# EAGLE design scheme (EAGLE 6.5.0)
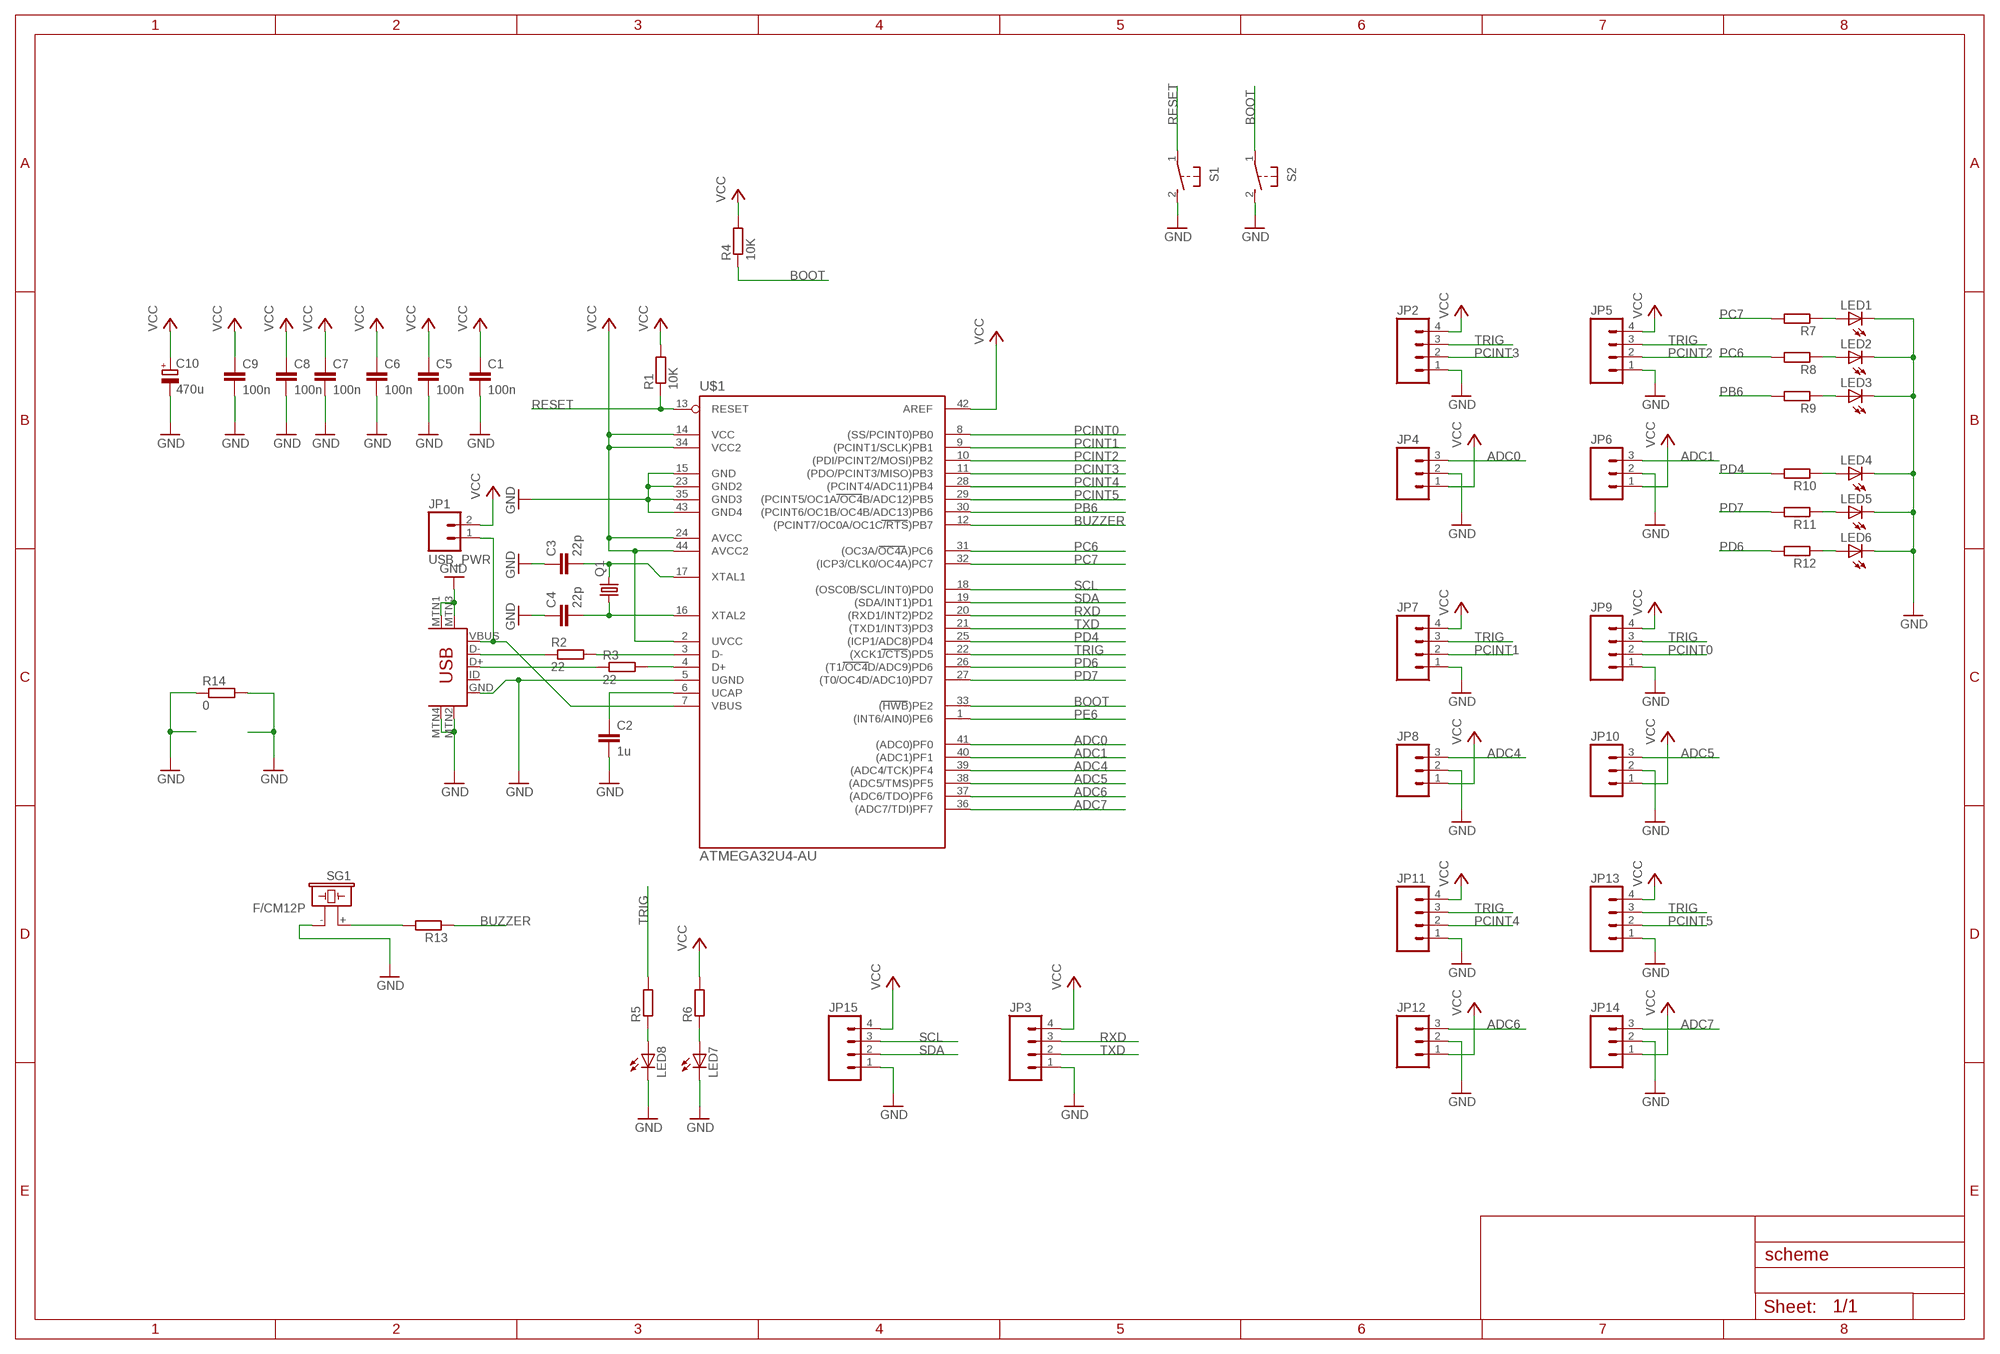
[diagram p0: schematic, sheet 1]

## Parts
C1  100n  C-EUC0805  [C0805]
C2  1u  C-EUC0805  [C0805]
C3  22p  C-EUC0805  [C0805]
C4  22p  C-EUC0805  [C0805]
C5  100n  C-EUC0805  [C0805]
C6  100n  C-EUC0805  [C0805]
C7  100n  C-EUC0805  [C0805]
C8  100n  C-EUC0805  [C0805]
C9  100n  C-EUC0805  [C0805]
C10  470u  CPOL-EUE3.5-8  [E3,5-8]
JP1  USB_PWR  M02PTH  [1X02]
JP2  M04PTH  [1X04]
JP3  M04PTH  [1X04]
JP4  M03PTH  [1X03]
JP5  M04PTH  [1X04]
JP6  M03PTH  [1X03]
JP7  M04PTH  [1X04]
JP8  M03PTH  [1X03]
JP9  M04PTH  [1X04]
JP10  M03PTH  [1X03]
JP11  M04PTH  [1X04]
JP12  M03PTH  [1X03]
JP13  M04PTH  [1X04]
JP14  M03PTH  [1X03]
JP15  M04PTH  [1X04]
LED1  LEDSMT1206  [1206]
LED2  LEDSMT1206  [1206]
LED3  LEDSMT1206  [1206]
LED4  LEDSMT1206  [1206]
LED5  LEDSMT1206  [1206]
LED6  LEDSMT1206  [1206]
LED7  LEDSMT1206  [1206]
LED8  LEDSMT1206  [1206]
Q1  CRYSTALHC49S  [HC49/S]
R1  10K  R-EU_R0805  [R0805]
R2  22  R-EU_R0805  [R0805]
R3  22  R-EU_R0805  [R0805]
R4  10K  R-EU_R0805  [R0805]
R5  R-EU_M0805  [M0805]
R6  R-EU_M0805  [M0805]
R7  R-EU_M0805  [M0805]
R8  R-EU_M0805  [M0805]
R9  R-EU_M0805  [M0805]
R10  R-EU_M0805  [M0805]
R11  R-EU_M0805  [M0805]
R12  R-EU_M0805  [M0805]
R13  R-EU_M0805  [M0805]
R14  0  R-EU_M1206  [M1206]
S1  31-XX  [B3F-31XX]
S2  31-XX  [B3F-31XX]
SG1  F/CM12P  [F/CM12P]
U$1  ATMEGA32U4-AU  [TQFP44]
U$2  USB-MINIB-5PIN  [USB-MINIB]

## Nets
ADC0: JP4.3 U$1.41((ADC0)PF0)
ADC1: JP6.3 U$1.40((ADC1)PF1)
ADC4: JP8.3 U$1.39((ADC4/TCK)PF4)
ADC5: JP10.3 U$1.38((ADC5/TMS)PF5)
ADC6: JP12.3 U$1.37((ADC6/TDO)PF6)
ADC7: JP14.3 U$1.36((ADC7/TDI)PF7)
BOOT: R4.1 S2.1(P) U$1.33((HWB)PE2)
BUZZER: R13.1 U$1.12((PCINT7/OC0A/OC1C/RTS)PB7)
GND: C1.2 C2.2 C3.1 C4.1 C5.2 C6.2 C7.2 C8.2 C9.2 C10.- JP2.1 JP3.1 JP4.2 JP5.1 JP6.2 JP7.1 JP8.2 JP9.1 JP10.2 JP11.1 JP12.2 JP13.1 JP14.2 JP15.1 LED1.C LED2.C LED3.C LED4.C LED5.C LED6.C LED7.C LED8.C R14.1 R14.2 S1.2(S) S2.2(S) SG1.- U$1.5(UGND) U$1.15(GND) U$1.23(GND2) U$1.35(GND3) U$1.43(GND4) U$2.GND U$2.MTN1(MTN2) U$2.MTN2(MTN3) U$2.MTN3(MTN1) U$2.MTN4
N$1: JP1.1 U$1.7(VBUS) U$2.VBUS
N$2: R2.1 U$2.D-
N$3: R2.2 U$1.3(D-)
N$4: R3.2 U$1.4(D+)
N$5: R3.1 U$2.D+
N$11: C2.1 U$1.6(UCAP)
N$12: C4.2 Q1.1 U$1.16(XTAL2)
N$13: C3.2 Q1.2 U$1.17(XTAL1)
N$14: LED1.A R7.1
N$15: LED2.A R8.1
N$16: LED3.A R9.1
N$17: LED4.A R10.1
N$18: LED5.A R11.1
N$19: LED6.A R12.1
N$20: R13.2 SG1.+
N$22: LED8.A R5.1
N$23: LED7.A R6.1
PB6: R9.2 U$1.30((PCINT6/OC1B/OC4B/ADC13)PB6)
PC6: R8.2 U$1.31((OC3A/OC4A)PC6)
PC7: R7.2 U$1.32((ICP3/CLK0/OC4A)PC7)
PCINT0: JP9.2 U$1.8((SS/PCINT0)PB0)
PCINT1: JP7.2 U$1.9((PCINT1/SCLK)PB1)
PCINT2: JP5.2 U$1.10((PDI/PCINT2/MOSI)PB2)
PCINT3: JP2.2 U$1.11((PDO/PCINT3/MISO)PB3)
PCINT4: JP11.2 U$1.28((PCINT4/ADC11)PB4)
PCINT5: JP13.2 U$1.29((PCINT5/OC1A/OC4B/ADC12)PB5)
PD4: R10.2 U$1.25((ICP1/ADC8)PD4)
PD6: R12.2 U$1.26((T1/OC4D/ADC9)PD6)
PD7: R11.2 U$1.27((T0/OC4D/ADC10)PD7)
PE6: U$1.1((INT6/AIN0)PE6)
RESET: R1.1 S1.1(P) U$1.13(RESET)
RXD: JP3.3 U$1.20((RXD1/INT2)PD2)
SCL: JP15.3 U$1.18((OSC0B/SCL/INT0)PD0)
SDA: JP15.2 U$1.19((SDA/INT1)PD1)
TRIG: JP2.3 JP5.3 JP7.3 JP9.3 JP11.3 JP13.3 R5.2 U$1.22((XCK1/CTS)PD5)
TXD: JP3.2 U$1.21((TXD1/INT3)PD3)
VCC: C1.1 C5.1 C6.1 C7.1 C8.1 C9.1 C10.+ JP1.2 JP2.4 JP3.4 JP4.1 JP5.4 JP6.1 JP7.4 JP8.1 JP9.4 JP10.1 JP11.4 JP12.1 JP13.4 JP14.1 JP15.4 R1.2 R4.2 R6.2 U$1.2(UVCC) U$1.14(VCC) U$1.24(AVCC) U$1.34(VCC2) U$1.42(AREF) U$1.44(AVCC2)
Unconnected: U$2.ID

## Library data of the parts
C1-C9 = rcl:C-EU: CAPACITOR, European symbol
C10 = rcl:CPOL-EU: POLARIZED CAPACITOR, European symbol
JP1 = SparkFun-Connectors:M02: Standard 2-pin 0.1" header. Use with - straight break away headers ( PRT-00116) - right angle break away headers (PRT-00553) - swiss pins (PRT-00743) - machine pins (PRT-00117) - female headers (PRT-00115) Molex polarized connector foot print use with: PRT-08233 with associated crimp pins and housings. 2.54_SCREWTERM for use with PRT-10571. 3.5mm Screw Terminal footprints for PRT-08084 5mm Screw Terminal footprints for use with PRT-08433
JP2 JP3 JP5 JP7 JP9 JP11 JP13 JP15 = SparkFun-Connectors:M04: Header 4 Standard 4-pin 0.1" header. Use with straight break away headers (SKU : PRT-00116), right angle break away headers (PRT-00553), swiss pins (PRT-00743), machine pins (PRT-00117), and female headers (PRT-00115). Molex polarized connector foot print use with SKU : PRT-08231 with associated crimp pins and housings. 1MM SMD Version SKU: PRT-10208
JP4 JP6 JP8 JP10 JP12 JP14 = SparkFun-Connectors:M03: Header 3 Standard 3-pin 0.1" header. Use with straight break away headers (SKU : PRT-00116), right angle break away headers (PRT-00553), swiss pins (PRT-00743), machine pins (PRT-00117), and female headers (PRT-00115). Molex polarized connector foot print use with SKU : PRT-08232 with associated crimp pins and housings.
LED1-LED8 = led:LED: LED OSRAM: - CHIPLED LG R971, LG N971, LY N971, LG Q971, LY Q971, LO R971, LY R971 LH N974, LH R974 LS Q976, LO Q976, LY Q976 LO Q996 - Hyper CHIPLED LW Q18S LB Q993, LB Q99A, LB R99A - SideLED LS A670, LO A670, LY A670, LG A670, LP A670 LB A673, LV A673, LT A673, LW A673 LH A674 LY A675 LS A676, LA A676, LO A676, LY A676, LW A676 LS A679, LY A679, LG A679 - Hyper Micro SIDELED® LS Y876, LA Y876, LO Y876, LY Y876 LT Y87S - SmartLED LW L88C, LW L88S LB L89C, LB L89S, LG L890 LS L89K, LO L89K, LY L89K LS L896, LA L896, LO L896, LY L896 - TOPLED LS T670, LO T670, LY T670, LG T670, LP T670 LSG T670, LSP T670, LSY T670, LOP T670, LYG T670 LG T671, LOG T671, LSG T671 LB T673, LV T673, LT T673, LW T673 LH T674 LS T676, LA T676, LO T676, LY T676, LB T676, LH T676, LSB T676, LW T676 LB T67C, LV T67C, LT T67C, LS T67K, LO T67K, LY T67K, LW E67C LS E67B, LA E67B, LO E67B, LY E67B, LB E67C, LV E67C, LT E67C LW T67C LS T679, LY T679, LG T679 LS T770, LO T770, LY T770, LG T770, LP T770 LB T773, LV T773, LT T773, LW T773 LH T774 LS E675, LA E675, LY E675, LS T675 LS T776, LA T776, LO T776, LY T776, LB T776 LHGB T686 LT T68C, LB T68C - Hyper Mini TOPLED® LB M676 - Mini TOPLED Santana® LG M470 LS M47K, LO M47K, LY M47K Source: http://www.osram.convergy.de LUXEON: - LUMILED® LXK2-PW12-R00, LXK2-PW12-S00, LXK2-PW14-U00, LXK2-PW14-V00 LXK2-PM12-R00, LXK2-PM12-S00, LXK2-PM14-U00 LXK2-PE12-Q00, LXK2-PE12-R00, LXK2-PE12-S00, LXK2-PE14-T00, LXK2-PE14-U00 LXK2-PB12-K00, LXK2-PB12-L00, LXK2-PB12-M00, LXK2-PB14-N00, LXK2-PB14-P00, LXK2-PB14-Q00 LXK2-PR12-L00, LXK2-PR12-M00, LXK2-PR14-Q00, LXK2-PR14-R00 LXK2-PD12-Q00, LXK2-PD12-R00, LXK2-PD12-S00 LXK2-PH12-R00, LXK2-PH12-S00 LXK2-PL12-P00, LXK2-PL12-Q00, LXK2-PL12-R00 Source: www.luxeon.com KINGBRIGHT: KA-3528ASYC Source: www.kingbright.com
Q1 = crystal:CRYSTAL: CRYSTAL; OC_FARNELL: 1667008; OC_NEWARK: unknown
R1-R14 = rcl:R-EU_: RESISTOR, European symbol
S1 S2 = switch-omron:31-XX: OMRON SWITCH; MPN: B3F-3100; OC_FARNELL: 959704; OC_NEWARK: 36M3582
SG1 = buzzer:F/CM12P: BUZZER Source: Buerklin; OC_FARNELL: unknown; OC_NEWARK: unknown
U$1 = mega32U4:ATMEGA32U4-AU
U$2 = SparkFun-Connectors:USB-MINIB: Mini-USB "B" connector with 5th pin broken out. Created new symbol breaking out 5th "ID" pin in mini/micro USB connector spec. See: http://en.wikipedia.org/wiki/Mini_usb#Cables. Uses same footprint as 4-pin symbol. Also added pins to connect to mounting / shield pads if required (probably not generally needed as signals aren't shielded once they leave the connector).

## Board
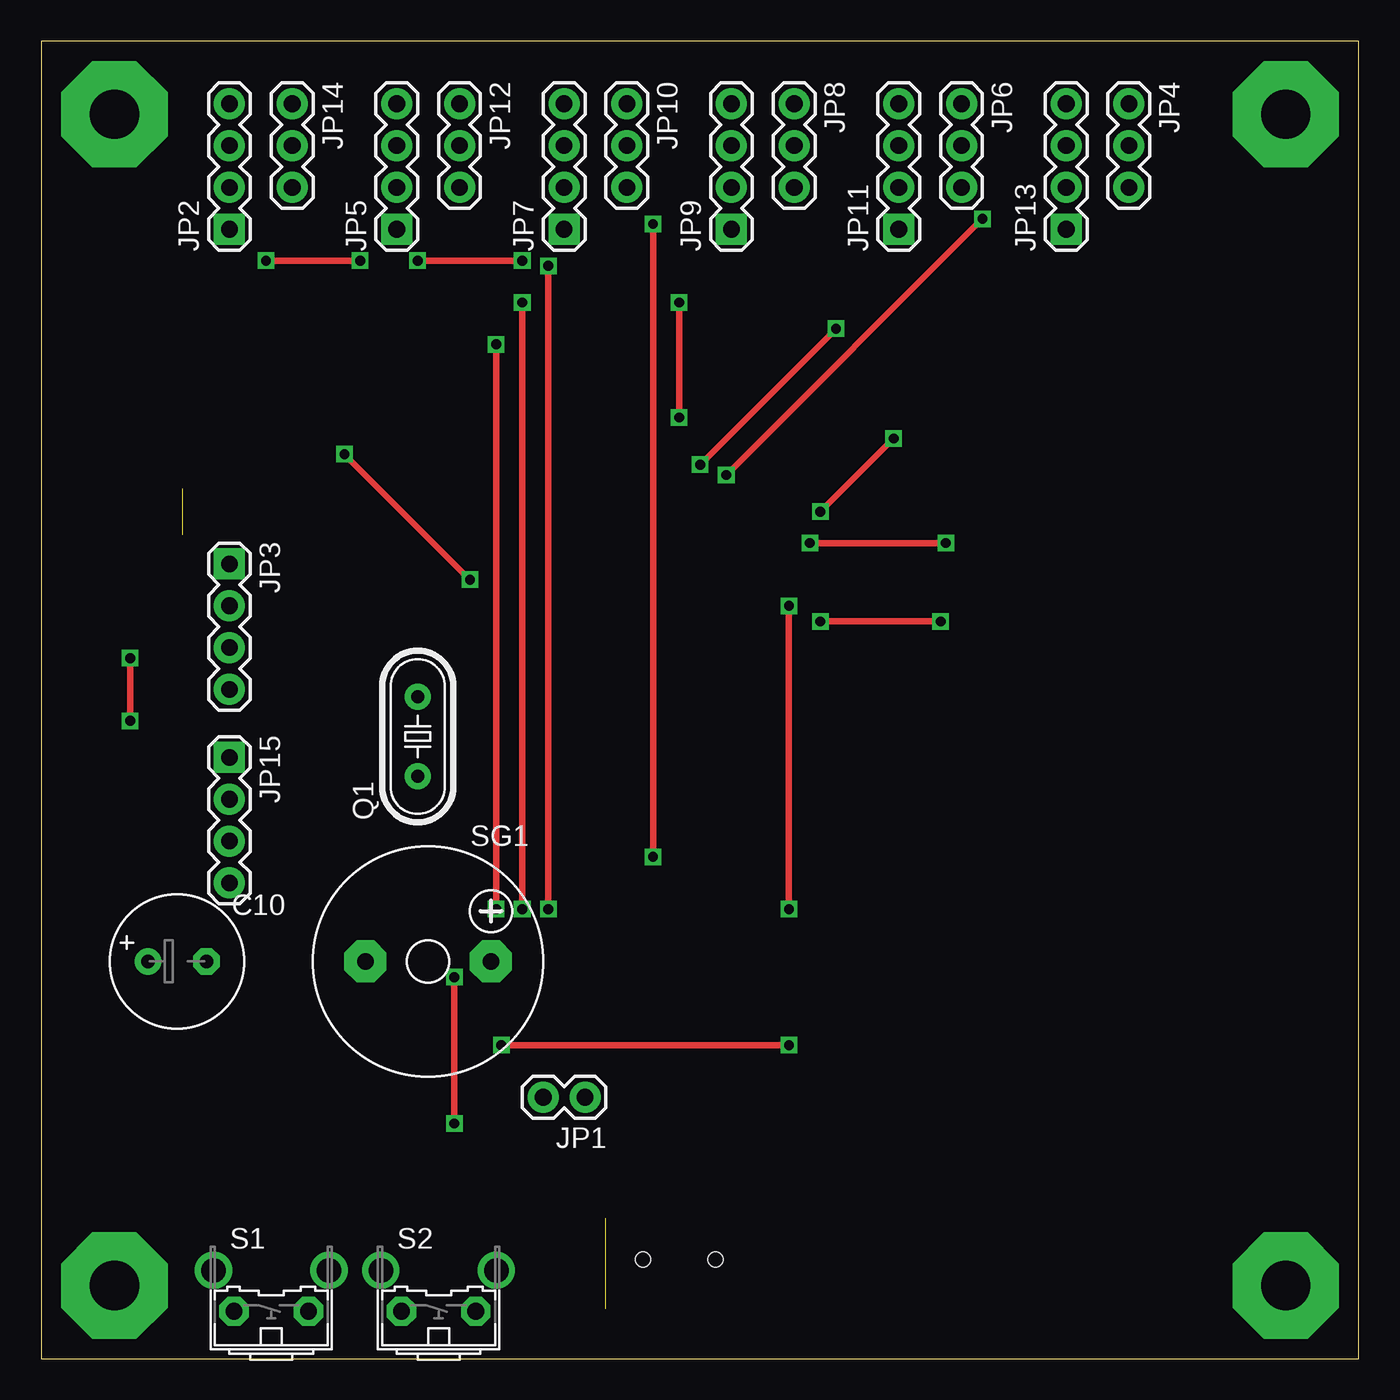
[diagram p1: board, top side]
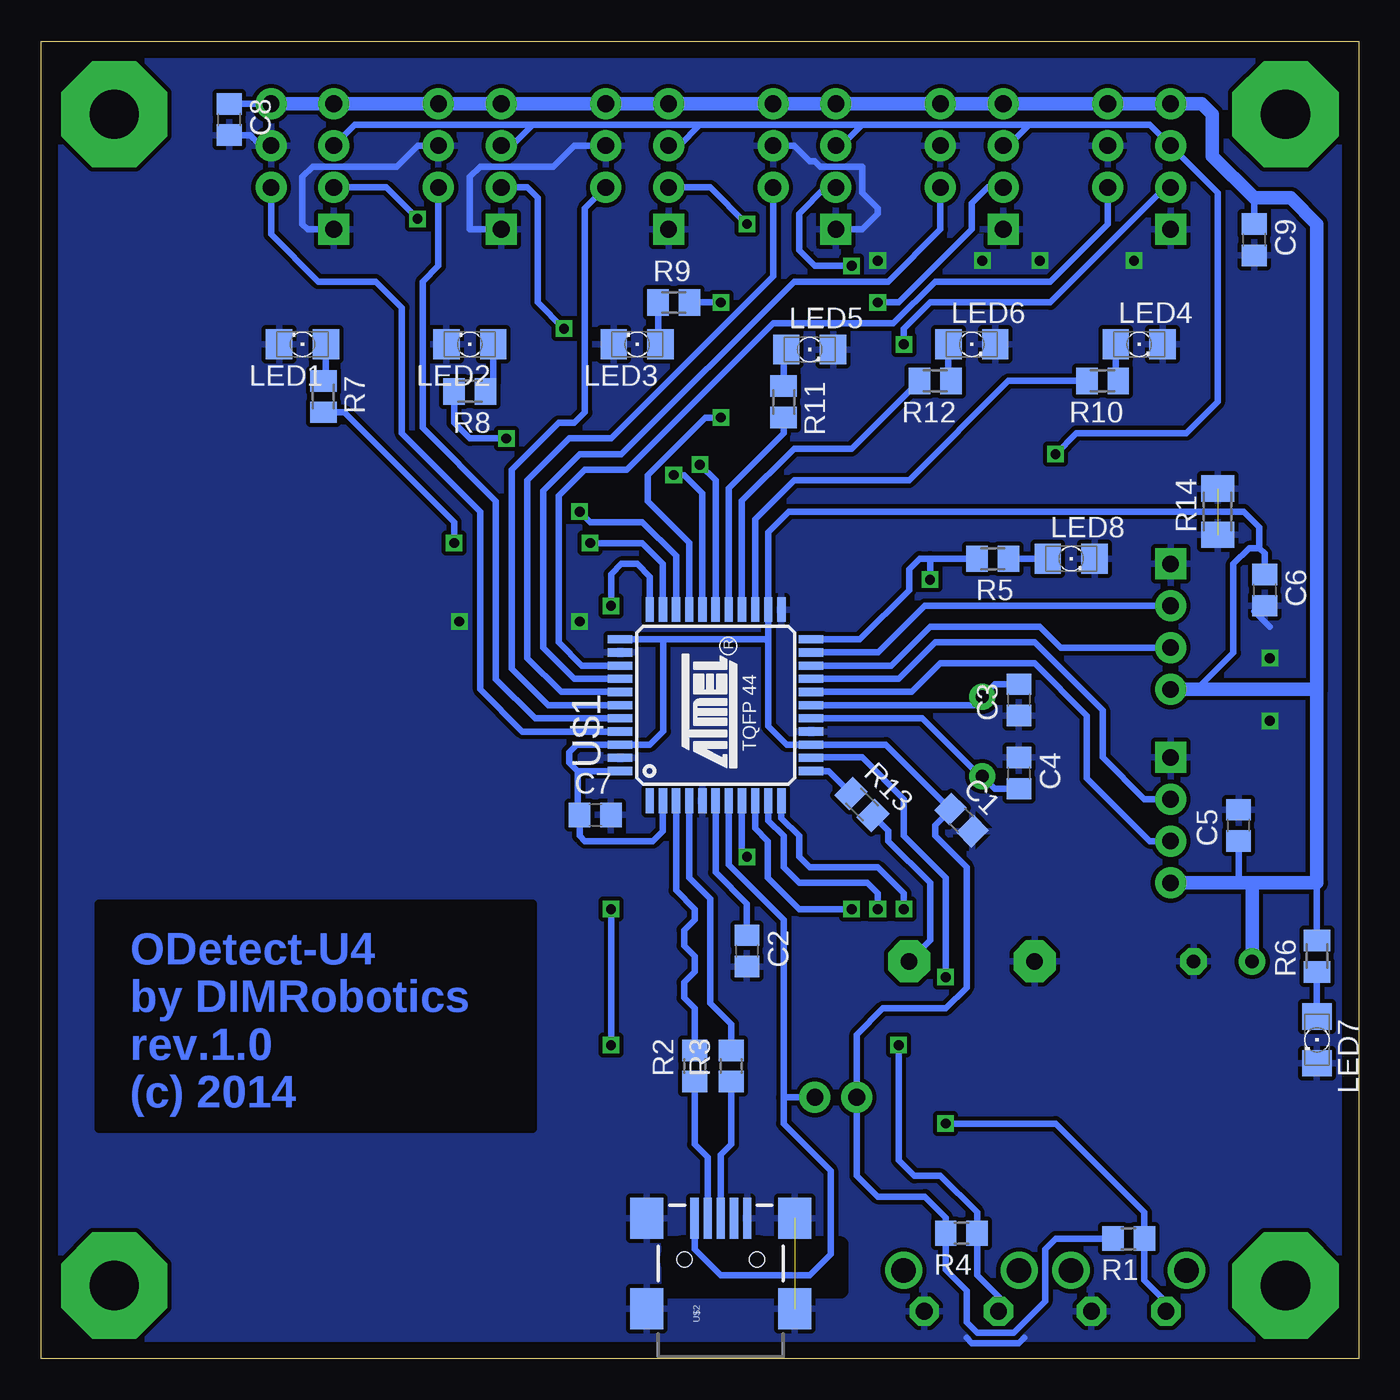
[diagram p2: board, bottom side, seen from below]

Size 80 x 80 mm. Coordinates in mm from the lower left corner, seen from the top.
Outline: 0,0 80,0 80,80 0,80 0,0
Copper layers (1*16): Top 0.035mm / dielectric 1.5mm / Bottom 0.035mm
Design rules "lut": minimum track width 10mil, minimum drill 24mil, track to track 8mil, track to pad 8mil, pad to pad 8mil, via to via 8mil, smd to smd 8mil, copper to edge 40mil, drill to drill 8mil, minimum pad ring 15mil, minimum via ring 8mil, stop-mask expansion 4mil, vias tented up to drill 0mil, thermal gap 10mil
bRestrict: 8 lines

### Footprints (pad centres in the part's own frame; a part is rotated, then mirrored left to right if it is on the bottom)
C0805 = smd 1.3 x 1.5: 1 -0.95,0; 2 0.95,0
E3,5-8 = drill 0.813 pad 1.6: + -1.778,0 | drill 0.813 pad 1.6 octagon: - 1.778,0
1X02 = drill 1.016 pad 1.88: 1 0,0; 2 2.54,0
1X04 = drill 1.016 pad 1.88 square: 1 0,0 | drill 1.016 pad 1.88: 2 2.54,0; 3 5.08,0; 4 7.62,0
1X03 = drill 1.016 pad 1.88: 1 0,0; 2 2.54,0; 3 5.08,0
1206 = smd 1.6 x 1.803: A -1.422,0; C 1.422,0
HC49/S = drill 0.813: 1 -2.413,0; 2 2.413,0
R0805 = smd 1.3 x 1.5: 1 -0.95,0; 2 0.95,0
M0805 = smd 1.3 x 1.6: 1 -0.95,0; 2 0.95,0
M1206 = smd 1.6 x 2: 1 -1.4,0; 2 1.4,0
B3F-31XX = drill 1.016 octagon: 1 -2.261,-1.245; 2 2.261,-1.245 | drill 1.499 pad 2.159: 3 -3.505,1.245; 4 3.505,1.245
F/CM12P = drill 1.016 pad 2.54 octagon: + 3.81,0; - -3.81,0
TQFP44 = smd 1.5 x 0.5: 1 -5.8,4; 2 -5.8,3.2; 3 -5.8,2.4; 4 -5.8,1.6; 5 -5.8,0.8; 6 -5.8,0; 7 -5.8,-0.8; 8 -5.8,-1.6; 9 -5.8,-2.4; 10 -5.8,-3.2; 11 -5.8,-4; 23 5.8,-4; 24 5.8,-3.2; 25 5.8,-2.4; 26 5.8,-1.6; 27 5.8,-0.8; 28 5.8,0; 29 5.8,0.8; 30 5.8,1.6; 31 5.8,2.4; 32 5.8,3.2; 33 5.8,4 | smd 0.5 x 1.5: 12 -4,-5.8; 13 -3.2,-5.8; 14 -2.4,-5.8; 15 -1.6,-5.8; 16 -0.8,-5.8; 17 0,-5.8; 18 0.8,-5.8; 19 1.6,-5.8; 20 2.4,-5.8; 21 3.2,-5.8; 22 4,-5.8; 34 4,5.8; 35 3.2,5.8; 36 2.4,5.8; 37 1.6,5.8; 38 0.8,5.8; 39 0,5.8; 40 -0.8,5.8; 41 -1.6,5.8; 42 -2.4,5.8; 43 -3.2,5.8; 44 -4,5.8
USB-MINIB = smd 2.5 x 0.5: D+ 2.5,0; D- 2.5,0.8; GND 2.5,-1.6; ID 2.5,-0.8; VBUS 2.5,1.6 | smd 2.5 x 2: MTN1 -3,4.5; MTN2 2.5,4.5; MTN3 -3,-4.5; MTN4 2.5,-4.5 | hole 0.9: 0,2.2; 0,-2.2

### Placement (x,y rotation side)
C1  24.13,32.7 315 bottom
C2  37.15,24.77 270 bottom
C3  20.64,40.01 90 bottom
C4  20.64,35.56 270 bottom
C5  7.3,32.38 90 bottom
C6  5.71,46.67 270 bottom
C7  46.35,33.02 0 bottom
C8  68.58,75.25 270 bottom
C9  6.35,67.94 270 bottom
C10  8.26,24.13 0 top
JP1  33.02,15.88 180 top
JP2  11.43,68.58 90 top
JP3  11.43,48.26 270 top
JP4  66.04,76.2 270 top
JP5  21.59,68.58 90 top
JP6  55.88,76.2 270 top
JP7  31.75,68.58 90 top
JP8  45.72,76.2 270 top
JP9  41.91,68.58 90 top
JP10  35.56,76.2 270 top
JP11  52.07,68.58 90 top
JP12  25.4,76.2 270 top
JP13  62.23,68.58 90 top
JP14  15.24,76.2 270 top
JP15  11.43,36.51 270 top
LED1  64.14,61.59 180 bottom
LED2  53.98,61.59 180 bottom
LED3  43.81,61.59 180 bottom
LED4  13.34,61.59 0 bottom
LED5  33.34,61.28 0 bottom
LED6  23.5,61.59 0 bottom
LED7  2.54,19.37 270 bottom
LED8  17.46,48.58 0 bottom
Q1  22.86,37.78 90 top
R1  13.97,7.3 180 bottom
R2  40.32,17.78 90 bottom
R3  38.1,17.78 90 bottom
R4  24.13,7.62 180 bottom
R5  22.23,48.58 180 bottom
R6  2.54,24.45 90 bottom
R7  62.87,58.42 270 bottom
R8  53.98,58.74 180 bottom
R9  41.59,64.14 0 bottom
R10  15.56,59.37 180 bottom
R11  34.92,58.1 270 bottom
R12  25.72,59.37 180 bottom
R13  30.16,33.66 315 bottom
R14  8.57,51.44 90 bottom
S1  13.97,4.13 0 top
S2  24.13,4.13 0 top
SG1  23.5,24.13 0 top
U$1  39.05,39.69 90 bottom
U$2  38.73,6.03 90 bottom

### Tracks (layer width: path | path; a pad name or v marks a point on that pad's centre or on a via)
ADC0
  Bottom 0.406: U$1.41 50.79,38.09 53.34,40.64 53.34,51.44 58.1,56.2 58.1,63.82 59.69,65.41 63.18,65.41 66.04,68.26 JP4.3
ADC1
  Bottom 0.406: JP6.3 55.88,66.36 56.83,65.41 56.83,56.52 52.39,52.07 52.39,41.27 50,38.89 U$1.40
ADC4
  Bottom 0.406: U$1.39 49.21,39.69 51.44,41.91 51.44,53.98 48.58,56.83 47.62,56.83 46.99,57.47 46.99,69.85 JP8.3
ADC5
  Bottom 0.406: JP10.3 35.56,65.72 45.4,55.88 47.94,55.88 50.48,53.34 50.48,42.55 48.42,40.49 U$1.38
ADC6
  Bottom 0.406: U$1.37 47.64,41.29 49.53,43.18 49.53,52.7 47.31,54.93 44.77,54.93 34.29,65.41 28.57,65.41 25.4,68.58 JP12.3
ADC7
  Bottom 0.406: U$1.36 47.17,42.09 48.58,43.5 48.58,52.39 46.99,53.98 44.45,53.98 35.56,62.87 28.26,62.87 25.72,65.41 18.73,65.41 15.24,68.9 JP14.3
BOOT  (via drill 0.6, 0.6 pad 0.25)
  Top 0.406: v45.4,45.72 v45.4,27.3 | v45.4,19.05 v27.94,19.05
  Bottom 0.406: S2.1 21.87,3.77 23.18,5.08 R4.1 | U$1.33 43.05,47.5 43.81,48.26 44.77,48.26 45.4,47.62 v45.4,45.72 | v45.4,27.3 v45.4,19.05 | R4.1 | R4.1 23.18,8.89 25.4,11.11 26.99,11.11 27.94,12.06 v27.94,19.05
BUZZER
  Bottom 0.406: U$1.12 32.2,35.69 R13.1
GND  (via drill 0.6)  (2 unrouted)
  Top 0.406: v13.65,66.67 v19.37,66.67 | v22.86,66.67 v29.21,66.67 | v5.4,38.73 v5.4,42.55 | v47.31,44.77 v54.61,44.77
  Bottom 0.406: JP13.1 63.82,68.58 64.14,68.9 64.14,71.75 63.5,72.39 58.42,72.39 57.15,73.66 JP6.2 | JP11.1 53.98,68.58 53.98,71.75 53.34,72.39 48.9,72.39 47.62,73.66 JP8.2 | JP10.2 34.29,73.66 33.34,72.71 33.02,72.71 32.7,72.39 30.16,72.39 30.16,70.8 29.21,69.85 29.21,69.53 30.16,68.58 JP7.1 | 5.4,44.45 6.35,45.4 | JP4.2 66.67,73.66 67.31,74.3 C8.2 | 20.32,1.27 20.64,0.95 23.5,0.95 23.81,1.27
  pour Bottom (isolate 0.254): 0.32,80.64 80.64,80.64 80.64,-0.32 0.32,-0.32
N$1
  Bottom 0.406: U$1.7 38.25,30 34.92,26.67 34.92,15.88 | 34.92,15.88 34.92,14.29 32.07,11.43 32.07,6.35 33.34,5.08 38.73,5.08 40.32,6.67 40.32,8.52 U$2.VBUS | JP1.1 34.92,15.88
N$2
  Bottom 0.406: R2.1 40.32,13.02 39.53,12.23 U$2.D-
N$3
  Bottom 0.406: U$1.3 41.45,28.43 40.32,27.3 40.32,26.67 40.96,26.04 40.96,25.08 40.32,24.45 40.32,23.5 40.96,22.86 40.96,21.91 40.32,21.27 R2.2
N$4
  Bottom 0.406: U$1.4 40.65,29.22 39.37,27.94 39.37,21.59 38.1,20.32 R3.2
N$5
  Bottom 0.406: R3.1 38.1,13.02 38.73,12.38 U$2.D+
N$6  (via drill 3 pad 6.45)
  other vias: 4.45,75.56
N$7  (via drill 3 pad 6.45)
  other vias: 75.56,75.56
N$8  (via drill 3 pad 6.45)
  other vias: 75.56,4.45
N$9  (via drill 3 pad 6.45)
  other vias: 4.45,4.45
N$11
  Bottom 0.406: U$1.6 39.05,29.53 37.15,27.62 C2.1
N$12
  Bottom 0.406: C4.2 22.1,34.61 Q1.1 23.05,35.56 23.18,35.56 26.5,38.89 U$1.16
N$13
  Bottom 0.406: C3.2 22.1,40.95 Q1.2 23.37,39.69 U$1.17
N$14
  Bottom 0.406: LED1.A 62.71,59.52 R7.1
N$15
  Bottom 0.406: 52.7,59.06 R8.1 52.55,59.21 LED2.A
N$16
  Bottom 0.406: R9.1 42.54,61.6 LED3.A
N$17
  Bottom 0.406: R10.1 14.76,59.52 LED4.A
N$18
  Bottom 0.406: R11.1 34.92,61.11 LED5.A
N$19
  Bottom 0.406: R12.1 24.92,59.52 LED6.A
N$20
  Bottom 0.406: R13.2 | R13.2 28.57,32.07 28.57,31.43 26.04,28.89 26.04,25.4 SG1.+
N$22
  Bottom 0.406: R5.1 LED8.A
N$23
  Bottom 0.406: R6.1 LED7.A
PB6  (via drill 0.6)
  Top 0.406: v38.73,57.15 v38.73,64.14
  Bottom 0.406: U$1.30 40.65,49.54 43.18,52.07 43.18,53.66 39.69,57.15 v38.73,57.15 | v38.73,64.14 R9.2
PC6  (via drill 0.6)
  Top 0.406: v47.31,51.44 v51.75,55.88
  Bottom 0.406: U$1.31 41.45,48.76 43.5,50.8 46.67,50.8 v47.31,51.44 | v51.75,55.88 53.98,55.88 54.93,56.83 R8.2
PC7  (via drill 0.6)
  Top 0.406: v46.67,49.53 v54.93,49.53
  Bottom 0.406: U$1.32 42.25,48.28 43.5,49.53 v46.67,49.53 | v54.93,49.53 54.93,50.8 61.6,57.47 R7.2
PCINT0  (via drill 0.6)
  Top 0.406: v37.15,68.9 v37.15,30.48
  Bottom 0.406: JP9.2 39.37,71.12 v37.15,68.9 | U$1.8 37.45,30.79 v37.15,30.48
PCINT1  (via drill 0.6)
  Top 0.406: v30.8,66.36 v30.8,27.3
  Bottom 0.406: JP7.2 32.38,71.12 33.97,69.53 33.97,67.31 33.02,66.36 v30.8,66.36 | U$1.9 36.65,32.21 35.88,31.43 35.88,29.21 33.97,27.3 v30.8,27.3
PCINT2  (via drill 0.6)
  Top 0.406: v29.21,64.14 v29.21,27.3
  Bottom 0.406: JP5.2 22.54,71.12 23.5,70.17 23.5,68.58 27.94,64.14 v29.21,64.14 | U$1.10 35.85,32.68 34.92,31.75 34.92,29.84 33.97,28.89 29.84,28.89 29.21,28.26 v29.21,27.3
PCINT3  (via drill 0.6)
  Top 0.406: v27.62,61.59 v27.62,27.3
  Bottom 0.406: JP2.2 11.75,71.12 18.73,64.14 26.04,64.14 27.62,62.55 v27.62,61.59 | U$1.11 35.05,32.83 33.97,31.75 33.97,30.48 33.34,29.84 29.21,29.84 27.62,28.26 v27.62,27.3
PCINT4  (via drill 0.6)
  Top 0.406: v48.26,62.55 v40.01,54.29
  Bottom 0.406: JP11.2 50.48,71.12 49.85,70.48 49.85,64.14 v48.26,62.55 | v40.01,54.29 39.05,53.34 U$1.28
PCINT5  (via drill 0.6)
  Top 0.406: v57.15,69.22 v41.59,53.66
  Bottom 0.406: JP13.2 59.05,71.12 v57.15,69.22 | v41.59,53.66 40.96,53.66 39.85,52.55 U$1.29
PD4
  Bottom 0.406: U$1.25 36.65,50.98 34.29,53.34 27.3,53.34 21.27,59.37 R10.2
PD6
  Bottom 0.406: U$1.26 37.45,52.08 34.29,55.24 30.8,55.24 R12.2
PD7
  Bottom 0.406: U$1.27 38.25,52.87 34.92,56.2 R11.2
RESET  (via drill 0.6 pad 0.25)
  Top 0.406: v25.08,23.18 v25.08,14.29
  Bottom 0.406: U$1.13 33.23,36.51 30.16,36.51 27.62,33.97 27.62,31.75 25.08,29.21 v25.08,23.18 | S1.1 11.71,3.45 13.02,4.76 R1.1 13.02,8.89 18.41,14.29 v25.08,14.29
RXD
  Bottom 0.406: U$1.20 28.4,42.09 26.04,44.45 19.37,44.45 18.1,43.18 JP3.3
SCL
  Bottom 0.406: U$1.18 27.14,40.49 25.4,42.23 19.68,42.23 16.51,39.05 16.51,35.24 12.7,31.43 JP15.3
SDA
  Bottom 0.406: U$1.19 27.93,41.29 25.72,43.5 19.68,43.5 15.56,39.37 15.56,36.51 13.02,33.97 JP15.2
TRIG  (via drill 0.6)
  Top 0.406: v18.41,54.93 v26.04,47.31
  Bottom 0.406: 20,74.93 30.16,74.93 | 30.16,74.93 40.01,74.93 | 40.01,74.93 50.16,74.93 | 50.16,74.93 60.96,74.93 JP13.3 | JP11.3 51.44,73.66 50.16,74.93 | JP9.3 41.27,73.66 40.01,74.93 | JP7.3 31.43,73.66 30.16,74.93 | U$1.22 30.29,43.69 27.3,46.67 27.3,47.94 26.67,48.58 26.04,48.58 | 26.04,48.58 R5.2 | JP5.3 21.27,73.66 20,74.93 | 20,74.93 12.7,74.93 JP2.3 8.57,70.8 8.57,58.1 10.48,56.2 17.14,56.2 v18.41,54.93 | v26.04,47.31 26.04,48.58
TXD
  Bottom 0.406: U$1.21 29.18,42.89 26.35,45.72 JP3.2
VCC
  Bottom 0.406: 35.85,43.5 U$1.24 35.85,50.19 34.61,51.44 6.99,51.44 6.03,50.48 6.03,49.21 | 35.85,43.5 35.85,38.39 34.75,37.29 U$1.14 28.71,37.29 C1.1 24.8,33.3 25.72,32.38 25.72,31.75 23.81,29.84 23.81,22.54 25.08,21.27 28.89,21.27 30.48,19.68 JP1.2 30.48,11.11 29.21,9.84 26.35,9.84 25.08,8.57 R4.2 25.08,5.4 23.81,4.13 23.81,2.22 23.18,1.59 20.95,1.59 19.05,3.49 19.05,6.67 18.41,7.3 R1.2 | 42.23,33.91 U$1.2 42.25,32.04 42.86,31.43 46.99,31.43 47.31,31.75 C7.1 47.44,33.15 47.44,35.69 | U$1.34 42.23,43.69 | 42.23,43.69 36.04,43.69 35.85,43.5 | U$1.44 47.44,35.69 | 47.44,35.69 47.94,36.2 47.94,36.83 47.48,37.29 U$1.42 43.04,37.29 42.23,38.1 42.23,43.69 | JP3.4 9.84,40.64 7.62,42.86 7.62,48.26 6.67,49.21 6.03,49.21 | JP10.1 JP2.4 | C5.1 7.3,29.21 7.62,28.89 | C6.1 5.71,48.9 6.03,49.21 | C8.1 JP4.1 | 6.35,70.48 C9.1 | R6.2 2.54,28.89
  Bottom 0.813: JP4.1 JP13.4 JP6.1 JP11.4 JP8.1 JP9.4 JP10.1 JP7.4 JP12.1 JP5.4 JP14.1 JP2.4 9.53,76.2 8.89,75.56 8.89,73.03 6.35,70.48 4.13,70.48 2.54,68.9 2.54,40.64 | 2.54,40.64 2.54,28.89 6.67,28.89 | 2.54,40.64 JP3.4 | JP15.4 7.62,28.89 6.67,28.89 | C10.+ 6.48,28.7 6.67,28.89

### Text on the board
Bottom: ODetect-U4 / by DIMRobotics / rev.1.0 / (c) 2014